# EAGLE design vfdClock (EAGLE 5.09)
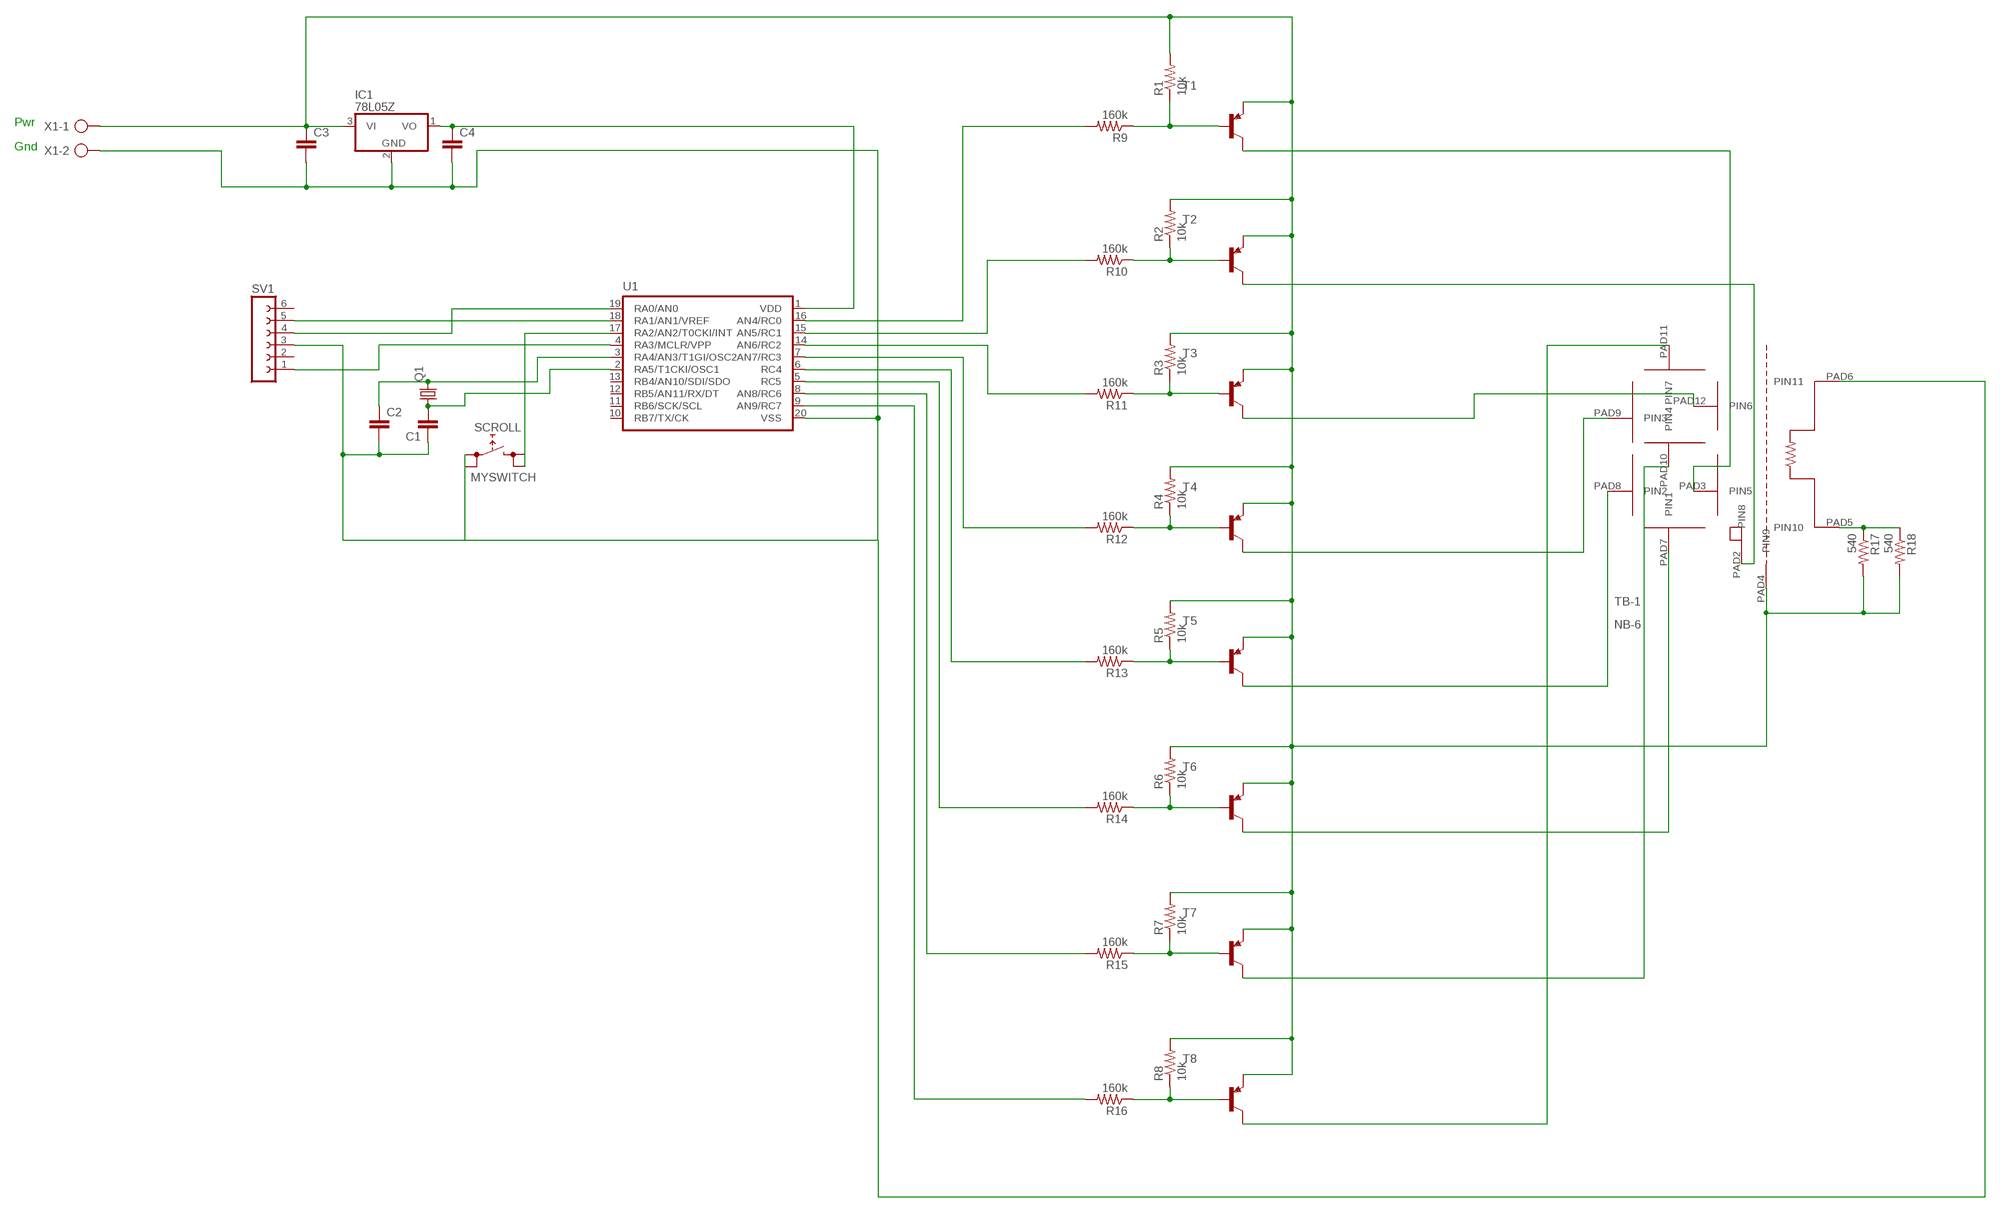
[diagram p0: schematic, sheet 1]

## Parts
C1  C2,5-3  [C2.5-3]
C2  C2,5-3  [C2.5-3]
C3  C2,5-3  [C2.5-3]
C4  C2,5-3  [C2.5-3]
IC1  78L05Z  [TO92]
Q1  CRYSTALTC26V  [TC26V]
R1  10k  R-US_0207/2V  [0207/2V]
R2  10k  R-US_0207/2V  [0207/2V]
R3  10k  R-US_0207/2V  [0207/2V]
R4  10k  R-US_0207/2V  [0207/2V]
R5  10k  R-US_0207/2V  [0207/2V]
R6  10k  R-US_0207/2V  [0207/2V]
R7  10k  R-US_0207/2V  [0207/2V]
R8  10k  R-US_0207/2V  [0207/2V]
R9  160k  R-US_0207/2V  [0207/2V]
R10  160k  R-US_0207/2V  [0207/2V]
R11  160k  R-US_0207/2V  [0207/2V]
R12  160k  R-US_0207/2V  [0207/2V]
R13  160k  R-US_0207/2V  [0207/2V]
R14  160k  R-US_0207/2V  [0207/2V]
R15  160k  R-US_0207/2V  [0207/2V]
R16  160k  R-US_0207/2V  [0207/2V]
R17  540  R-US_0207/2V  [0207/2V]
R18  540  R-US_0207/2V  [0207/2V]
SCROLL  MYSWITCH  [MYSWITCH]
SV1  FE06-1  [FE06]
T1  -PNP-TO92-EBC  [TO92-EBC]
T2  -PNP-TO92-EBC  [TO92-EBC]
T3  -PNP-TO92-EBC  [TO92-EBC]
T4  -PNP-TO92-EBC  [TO92-EBC]
T5  -PNP-TO92-EBC  [TO92-EBC]
T6  -PNP-TO92-EBC  [TO92-EBC]
T7  -PNP-TO92-EBC  [TO92-EBC]
T8  -PNP-TO92-EBC  [TO92-EBC]
TB-1  NB-6  NB-6VFD  [NB-6]
U1  PIC16F6XX  [DIL20]
X1  AK500/2-H  [AK500/2-H]

## Nets
N$1: R8.1 R16.1 T8.B
N$2: R7.1 R15.1 T7.B
N$3: R6.1 R14.1 T6.B
N$4: R5.1 R13.1 T5.B
N$5: R4.1 R12.1 T4.B
N$6: R3.1 R11.1 T3.B
N$7: R2.1 R10.1 T2.B
N$8: SV1.1 U1.4(RA3/MCLR/VPP)
N$9: R1.1 R9.1 T1.B
N$10: R9.2 U1.16(AN4/RC0)
N$11: R10.2 U1.15(AN5/RC1)
N$12: R11.2 U1.14(AN6/RC2)
N$13: R12.2 U1.7(AN7/RC3)
N$14: SV1.4 U1.19(RA0/AN0)
N$16: SV1.5 U1.18(RA1/AN1/VREF)
N$17: R13.2 U1.6(RC4)
N$18: R14.2 U1.5(RC5)
N$19: R15.2 U1.8(AN8/RC6)
N$20: T1.C TB-1.PAD3(PIN5)
N$21: R16.2 U1.9(AN9/RC7)
N$22: C3.1 IC1.3(VI) R1.2 R2.2 R3.2 R4.2 R5.2 R6.2 R7.2 R8.2 R17.2 R18.2 T1.E T2.E T3.E T4.E T5.E T6.E T7.E T8.E TB-1.PAD4(PIN9) X1.1
N$23: T3.C TB-1.PAD12(PIN6)
N$24: C1.2 Q1.1 U1.2(RA5/T1CKI/OSC1)
N$25: C1.1 C2.2 C3.2 C4.2 IC1.2(GND) SCROLL.A0 SCROLL.A1 SV1.3 TB-1.PAD6(PIN11) U1.20(VSS) X1.2
N$26: C2.1 Q1.2 U1.3(RA4/AN3/T1GI/OSC2)
N$27: T6.C TB-1.PAD7(PIN1)
N$28: T5.C TB-1.PAD8(PIN2)
N$29: T4.C TB-1.PAD9(PIN3)
N$30: C4.1 IC1.1(VO) U1.1(VDD)
N$31: T7.C TB-1.PAD10(PIN4)
N$32: T2.C TB-1.PAD2(PIN8)
N$33: T8.C TB-1.PAD11(PIN7)
N$34: SCROLL.B0 SCROLL.B1 U1.17(RA2/AN2/T0CKI/INT)
N$35: R17.1 R18.1 TB-1.PAD5(PIN10)
Unconnected: SV1.2 SV1.6 U1.10(RB7/TX/CK) U1.11(RB6/SCK/SCL) U1.12(RB5/AN11/RX/DT) U1.13(RB4/AN10/SDI/SDO)

## Notes on the sheet
- Pwr
- Gnd

## Library data of the parts
C1-C4 = capacitor-wima:C: CAPACITOR naming: grid - package width
IC1 = linear:78*: Positive VOLTAGE REGULATOR Source: http://cache.national.com/ds/LM/LM78L05.pdf http://www.fairchildsemi.com/ds/LM/LM7805.pdf
Q1 = crystal:CRYSTAL: CRYSTAL
R1-R18 = resistor:R-US_: RESISTOR, American symbol
SCROLL = switch:MYSWITCH
SV1 = con-lsta:FE06-1: FEMALE HEADER
T1-T8 = transistor-neu-to92:*-PNP-: PNP Transistror
TB-1 = tubes:NB-6VFD
U1 = pic16f690:PIC16F6XX
X1 = con-ptr500:AK500/2-H: CONNECTOR Aug. 2004 / PTR Meßtechnik: Die Bezeichnung der Serie AK505 wurde geändert. Es handelt sich hierbei um AK500 in horizontaler Ausführung.

## Board
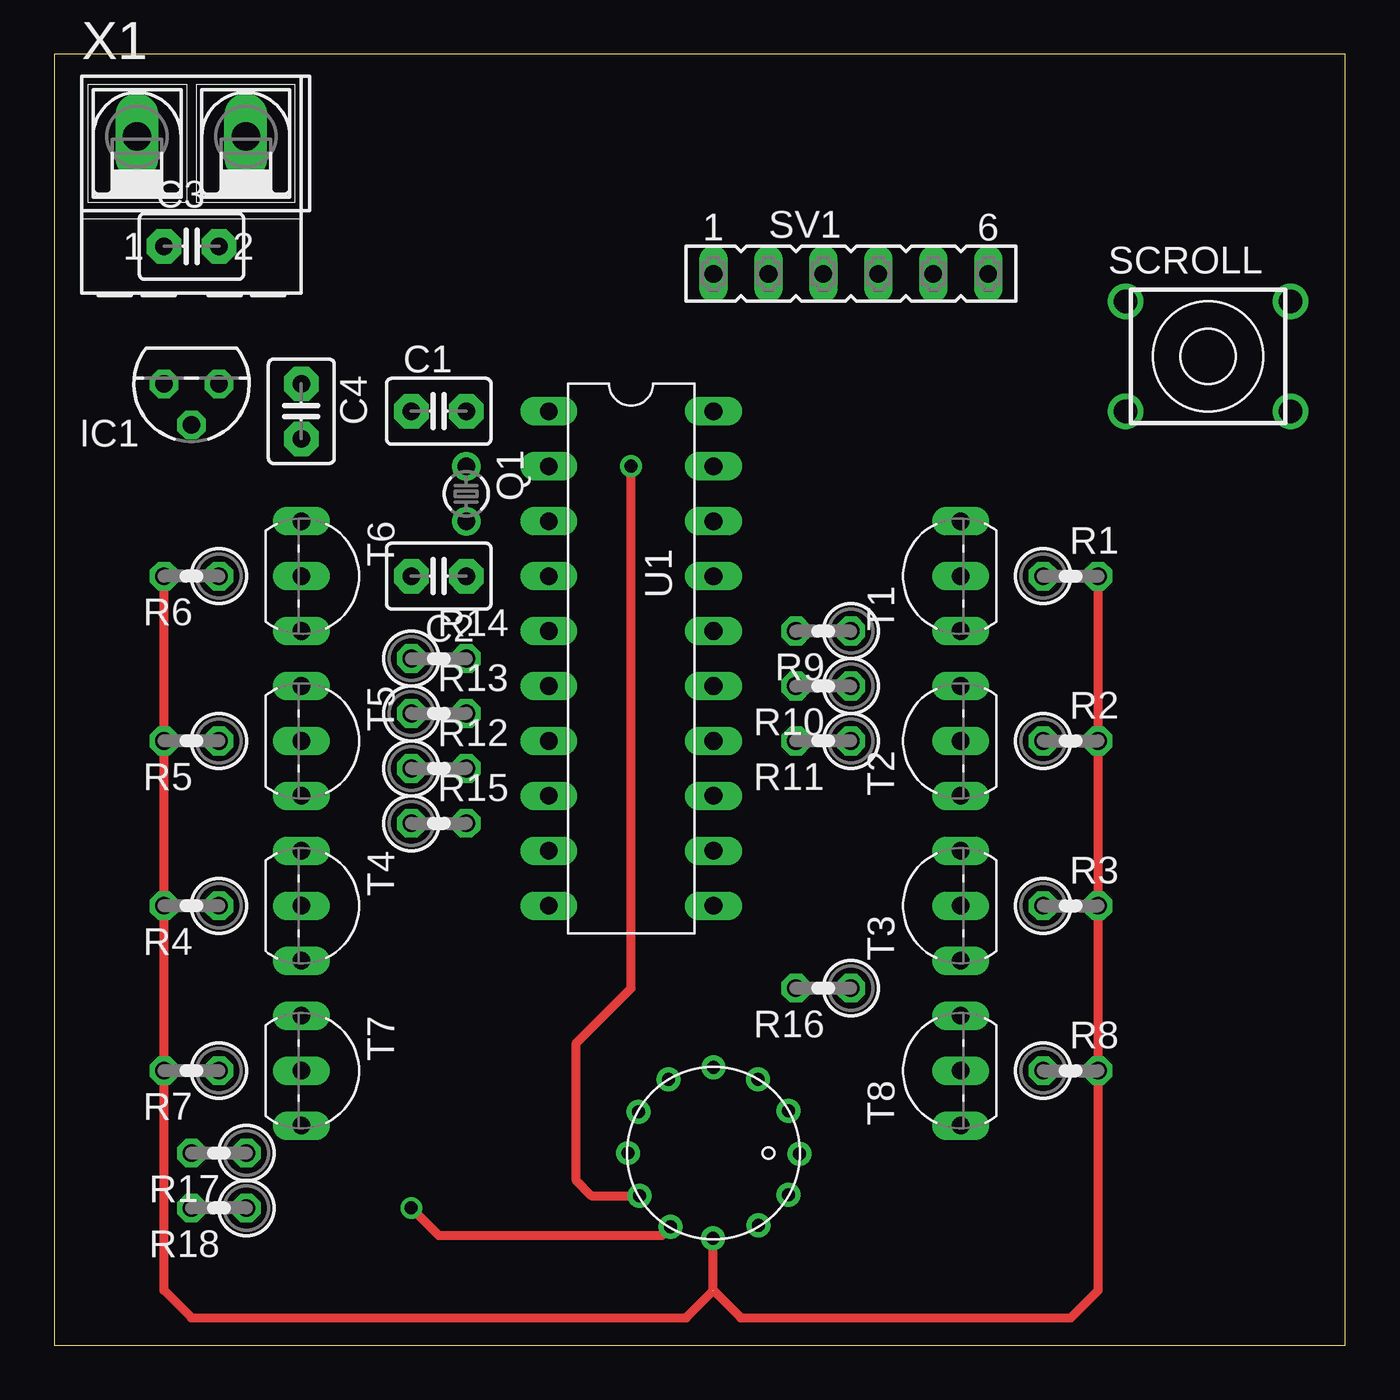
[diagram p1: board, top side]
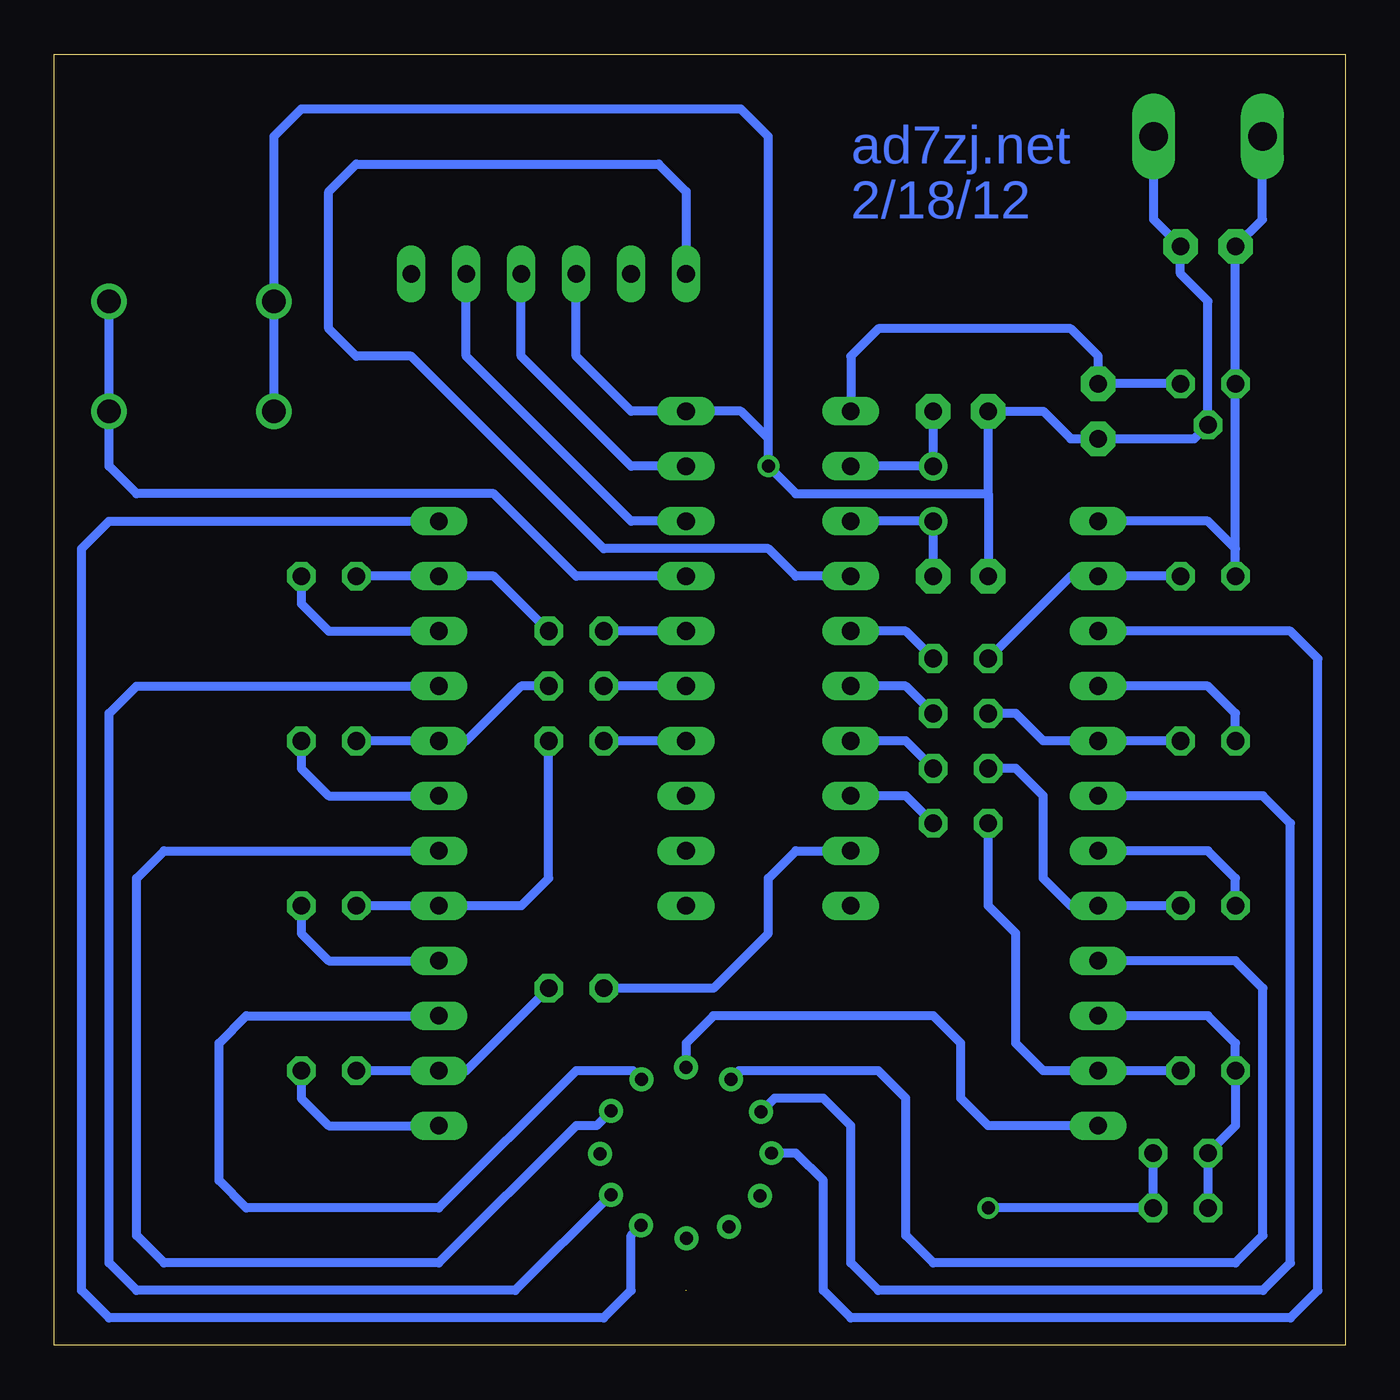
[diagram p2: board, bottom side, seen from below]

Size 59.69 x 59.69 mm. Coordinates in mm from the lower left corner, seen from the top.
Outline: 0,0 59.69,0 59.69,59.69 0,59.69 0,0
Copper layers (1*16): Top 0.035mm / dielectric 1.5mm / Bottom 0.035mm
Design rules "default": minimum track width 10mil, minimum drill 24mil, track to track 8mil, track to pad 8mil, pad to pad 8mil, via to via 8mil, smd to smd 8mil, copper to edge 40mil, drill to drill 8mil, minimum pad ring 10mil, minimum via ring 8mil, stop-mask expansion 4mil, vias tented up to drill 0mil, thermal gap 10mil

### Footprints (pad centres in the part's own frame; a part is rotated, then mirrored left to right if it is on the bottom)
C2.5-3 = drill 0.813 pad 1.6 octagon: 1 -1.27,0; 2 1.27,0
TO92 = drill 0.813 octagon: 1 -1.27,0; 2 0,1.905; 3 1.27,0
TC26V = drill 0.813 round: 1 -1.27,0; 2 1.27,0
0207/2V = drill 0.813 octagon: 1 -1.27,0; 2 1.27,0
MYSWITCH = drill 1.1 round: A0 -3.81,-2.54; A1 -3.81,2.54; B0 3.81,-2.54; B1 3.81,2.54
FE06 = drill 0.813 long: 1 -6.35,0; 2 -3.81,0; 3 -1.27,0; 4 1.27,0; 5 3.81,0; 6 6.35,0
TO92-EBC = drill 0.813 long: B 0,-1.27; C 2.54,-1.27; E -2.54,-1.27
NB-6 = drill 0.6 round: PAD1 7.794,-0.035; PAD2 7.286,-1.927; PAD3 5.881,-3.341; PAD4 3.798,-3.945; PAD5 1.813,-3.409; PAD6 0.395,-1.968; PAD7 -0.145,0; PAD8 0.335,1.915; PAD9 1.738,3.415; PAD10 3.81,3.955; PAD11 5.866,3.407; PAD12 7.265,1.952
DIL20 = drill 0.813 long: 1 -11.43,-3.81; 2 -8.89,-3.81; 3 -6.35,-3.81; 4 -3.81,-3.81; 5 -1.27,-3.81; 6 1.27,-3.81; 7 3.81,-3.81; 8 6.35,-3.81; 9 8.89,-3.81; 10 11.43,-3.81; 11 11.43,3.81; 12 8.89,3.81; 13 6.35,3.81; 14 3.81,3.81; 15 1.27,3.81; 16 -1.27,3.81; 17 -3.81,3.81; 18 -6.35,3.81; 19 -8.89,3.81; 20 -11.43,3.81
AK500/2-H = drill 1.321 long: 1 -2.515,0; 2 2.515,0

### Placement (x,y rotation side)
C1  17.78,43.18 0 top
C2  17.78,35.56 180 top
C3  6.35,50.8 0 top
C4  11.43,43.18 270 top
IC1  6.35,44.45 180 top
Q1  19.05,39.37 270 top
R1  46.99,35.56 0 top
R2  46.99,27.94 0 top
R3  46.99,20.32 0 top
R4  6.35,20.32 180 top
R5  6.35,27.94 180 top
R6  6.35,35.56 180 top
R7  6.35,12.7 180 top
R8  46.99,12.7 0 top
R9  35.56,33.02 180 top
R10  35.56,30.48 180 top
R11  35.56,27.94 180 top
R12  17.78,26.67 0 top
R13  17.78,29.21 0 top
R14  17.78,31.75 0 top
R15  17.78,24.13 0 top
R16  35.56,16.51 180 top
R17  7.62,8.89 180 top
R18  7.62,6.35 180 top
SCROLL  53.34,45.72 0 top
SV1  36.83,49.53 0 top
T1  40.64,35.56 90 top
T2  40.64,27.94 90 top
T3  40.64,20.32 90 top
T4  12.7,20.32 270 top
T5  12.7,27.94 270 top
T6  12.7,35.56 270 top
T7  12.7,12.7 270 top
T8  40.64,12.7 90 top
TB-1  26.67,8.89 0 top
U1  26.67,31.75 270 top
X1  6.35,55.88 0 top

### Tracks (layer width: path | path; a pad name or v marks a point on that pad's centre or on a via)
N$1
  Bottom 0.406: R8.1 T8.B 40.64,12.7 R16.1
N$2
  Bottom 0.406: R15.1 16.51,20.32 15.24,19.05 15.24,13.97 13.97,12.7 T7.B R7.1
N$3
  Bottom 0.406: R14.1 12.7,35.56 T6.B R6.1
N$4
  Bottom 0.406: R13.1 15.24,29.21 13.97,27.94 T5.B R5.1
N$5
  Bottom 0.406: R12.1 15.24,26.67 13.97,25.4 13.97,21.59 12.7,20.32 T4.B R4.1
N$6
  Bottom 0.406: R3.1 T3.B 38.1,20.32 36.83,21.59 R11.1
N$7
  Bottom 0.406: R2.1 T2.B 40.64,27.94 38.1,30.48 R10.1
N$8
  Bottom 0.406: U1.4 25.4,35.56 26.67,36.83 34.29,36.83 43.18,45.72 45.72,45.72 46.99,46.99 46.99,53.34 45.72,54.61 31.75,54.61 30.48,53.34 SV1.1
N$9
  Bottom 0.406: R1.1 T1.B 39.37,35.56 R9.1
N$10
  Bottom 0.406: U1.16 R9.2
N$11
  Bottom 0.406: U1.15 R10.2
N$12
  Bottom 0.406: U1.14 R11.2
N$13
  Bottom 0.406: R12.2 20.32,27.94 U1.7
N$14
  Bottom 0.406: U1.19 33.02,40.64 38.1,45.72 SV1.4
N$16
  Bottom 0.406: U1.18 33.02,38.1 40.64,45.72 SV1.5
N$17
  Bottom 0.406: R13.2 20.32,30.48 U1.6
N$18
  Bottom 0.406: R14.2 20.32,33.02 U1.5
N$19
  Bottom 0.406: R15.2 20.32,25.4 U1.8
N$20
  Bottom 0.406: T1.C 57.15,38.1 58.42,36.83 58.42,2.54 57.15,1.27 34.29,1.27 33.02,2.54 33.02,5.08 TB-1.PAD3
N$21
  Bottom 0.406: U1.9 25.4,22.86 26.67,21.59 26.67,19.05 29.21,16.51 R16.2
N$22  (1 unrouted)
  Top 0.406: 30.48,2.54 31.75,1.27 46.99,1.27 48.26,2.54 R8.2 R3.2 R2.2 R1.2 | R6.2 R5.2 R4.2 R7.2 5.08,2.54 6.35,1.27 29.21,1.27 30.47,2.53 TB-1.PAD4
  Bottom 0.406: T6.E 6.35,38.1 5.08,36.83 | R6.2 5.08,36.83 | T5.E 6.35,30.48 5.08,29.21 R5.2 | T4.E 6.35,22.86 5.08,21.59 R4.2 | T7.E 6.35,15.24 5.08,13.97 R7.2 5.08,10.16 R17.2 R18.2 | T8.E 46.99,10.16 48.26,11.43 R8.2 | T3.E 46.99,17.78 48.26,19.05 R3.2 | T2.E 46.99,25.4 48.26,26.67 R2.2 | T1.E 46.99,33.02 48.26,34.29 R1.2 | X1.1 3.83,52.05 C3.1 IC1.3 5.08,36.83
N$23
  Bottom 0.406: T3.C 54.61,22.86 55.88,21.59 55.88,5.08 54.61,3.81 41.91,3.81 35.56,10.16 34.62,10.16 TB-1.PAD12
N$24
  Bottom 0.406: U1.2 Q1.1 C1.2
N$25  (via drill 0.6)
  Top 0.406: TB-1.PAD6 24.83,6.92 24.13,7.62 24.13,13.97 26.67,16.51 v26.67,40.64
  Bottom 0.406: SV1.3 35.56,45.72 33.02,43.18 U1.20 27.94,43.18 26.67,41.91 | X1.2 8.87,52.05 C3.2 7.62,49.53 6.35,48.26 IC1.2 6.99,41.91 C4.2 12.7,41.91 13.97,43.18 C1.1 16.51,39.37 | 16.51,39.37 C2.2 | 16.51,39.37 25.4,39.37 v26.67,40.64 26.67,41.91 | 26.67,41.91 26.67,55.88 27.94,57.15 48.26,57.15 49.53,55.88 SCROLL.A1 SCROLL.A0
N$26
  Bottom 0.406: U1.3 Q1.2 C2.1
N$27
  Bottom 0.406: T6.C 2.54,33.02 1.27,31.75 1.27,2.54 2.54,1.27 22.86,1.27 24.13,2.54 24.13,7.62 25.4,8.89 TB-1.PAD7
N$28
  Bottom 0.406: T5.C 3.81,25.4 2.54,24.13 2.54,3.81 3.81,2.54 21.59,2.54 22.86,3.81 22.86,10.16 24.13,11.43 26.38,11.43 TB-1.PAD8
N$29
  Bottom 0.406: T4.C 5.08,17.78 3.81,16.51 3.81,5.08 5.08,3.81 19.05,3.81 20.32,5.08 20.32,11.43 21.59,12.7 28.01,12.7 TB-1.PAD9
N$30
  Bottom 0.406: U1.1 22.86,45.72 21.59,46.99 12.7,46.99 11.43,45.72 C4.1 IC1.1
N$31
  Bottom 0.406: T7.C 16.51,10.16 17.78,11.43 17.78,13.97 19.05,15.24 29.21,15.24 30.48,13.97 TB-1.PAD10
N$32
  Bottom 0.406: T2.C 55.88,30.48 57.15,29.21 57.15,3.81 55.88,2.54 38.38,2.54 TB-1.PAD2
N$33
  Bottom 0.406: T8.C 50.8,15.24 52.07,13.97 52.07,7.62 50.8,6.35 41.91,6.35 35.56,12.7 32.94,12.7 TB-1.PAD11
N$34
  Bottom 0.406: U1.17 35.56,35.56 39.37,39.37 55.88,39.37 57.15,40.64 SCROLL.B0 SCROLL.B1
N$35  (via drill 0.6)
  Top 0.406: v16.51,6.35 17.78,5.08 28.08,5.08 TB-1.PAD5
  Bottom 0.406: R17.1 R18.1 v16.51,6.35

### Text on the board
Bottom: ad7zj.net | 2/18/12